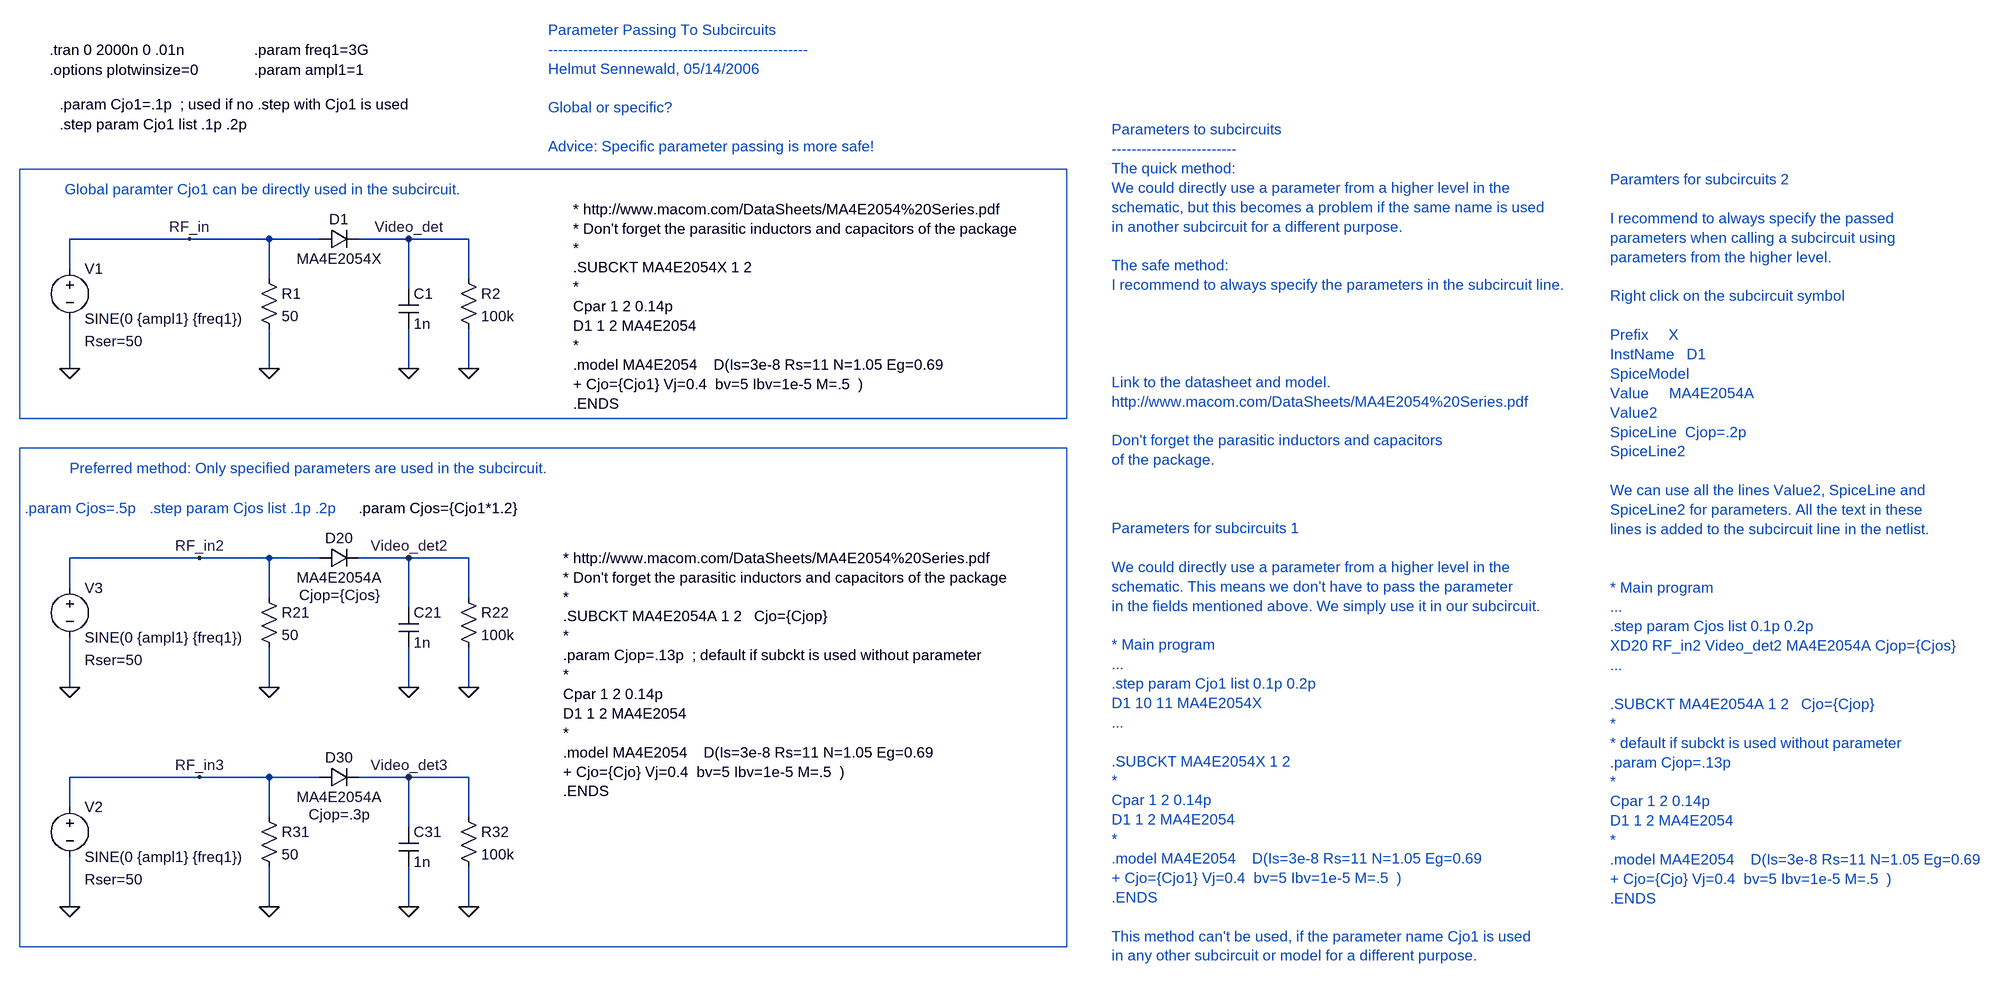
[diagram p0: schematic Param_to_sub_MA4E2054.asc]
Param_to_sub_MA4E2054.asc, the LTspice schematic file:
Version 4
SHEET 1 2796 1628
WIRE -496 48 -496 0
WIRE -496 208 -496 128
WIRE -496 560 -496 512
WIRE -496 720 -496 640
WIRE -496 912 -496 864
WIRE -496 1072 -496 992
WIRE -304 0 -496 0
WIRE -288 512 -496 512
WIRE -288 864 -496 864
WIRE -176 0 -304 0
WIRE -176 64 -176 0
WIRE -176 208 -176 144
WIRE -176 512 -288 512
WIRE -176 576 -176 512
WIRE -176 720 -176 656
WIRE -176 864 -288 864
WIRE -176 928 -176 864
WIRE -176 1072 -176 1008
WIRE -96 0 -176 0
WIRE -96 512 -176 512
WIRE -96 864 -176 864
WIRE 48 0 -32 0
WIRE 48 80 48 0
WIRE 48 208 48 144
WIRE 48 512 -32 512
WIRE 48 592 48 512
WIRE 48 720 48 656
WIRE 48 864 -32 864
WIRE 48 944 48 864
WIRE 48 1072 48 1008
WIRE 144 0 48 0
WIRE 144 64 144 0
WIRE 144 208 144 144
WIRE 144 512 48 512
WIRE 144 576 144 512
WIRE 144 720 144 656
WIRE 144 864 48 864
WIRE 144 928 144 864
WIRE 144 1072 144 1008
FLAG -496 208 0
FLAG -304 0 RF_in
FLAG -176 208 0
FLAG 48 208 0
FLAG 144 208 0
FLAG 48 0 Video_det
FLAG -176 1072 0
FLAG 48 1072 0
FLAG 144 1072 0
FLAG 48 864 Video_det3
FLAG -288 864 RF_in3
FLAG -176 720 0
FLAG 48 720 0
FLAG 144 720 0
FLAG 48 512 Video_det2
FLAG -496 1072 0
FLAG -496 720 0
FLAG -288 512 RF_in2
SYMBOL diode -96 16 R270
WINDOW 0 32 32 VTop 0
WINDOW 3 0 32 VBottom 0
SYMATTR InstName D1
SYMATTR Value MA4E2054X
SYMATTR Prefix X
SYMBOL res -192 48 R0
SYMATTR InstName R1
SYMATTR Value 50
SYMBOL voltage -496 32 R0
WINDOW 123 0 0 Left 0
WINDOW 39 24 132 Left 0
SYMATTR InstName V1
SYMATTR Value SINE(0 {ampl1} {freq1})
SYMATTR SpiceLine Rser=50
SYMBOL cap 32 80 R0
SYMATTR InstName C1
SYMATTR Value 1n
SYMBOL res 128 48 R0
SYMATTR InstName R2
SYMATTR Value 100k
SYMBOL diode -96 880 R270
WINDOW 0 32 32 VTop 0
WINDOW 3 0 32 VBottom 0
WINDOW 39 -28 32 VBottom 0
SYMATTR InstName D30
SYMATTR Value MA4E2054A
SYMATTR Prefix X
SYMATTR SpiceLine Cjop=.3p
SYMBOL res -192 912 R0
SYMATTR InstName R31
SYMATTR Value 50
SYMBOL cap 32 944 R0
SYMATTR InstName C31
SYMATTR Value 1n
SYMBOL res 128 912 R0
SYMATTR InstName R32
SYMATTR Value 100k
SYMBOL diode -96 528 R270
WINDOW 0 32 32 VTop 0
WINDOW 3 0 32 VBottom 0
WINDOW 39 -28 32 VBottom 0
SYMATTR InstName D20
SYMATTR Value MA4E2054A
SYMATTR Prefix X
SYMATTR SpiceLine Cjop={Cjos}
SYMBOL res -192 560 R0
SYMATTR InstName R21
SYMATTR Value 50
SYMBOL cap 32 592 R0
SYMATTR InstName C21
SYMATTR Value 1n
SYMBOL res 128 560 R0
SYMATTR InstName R22
SYMATTR Value 100k
SYMBOL voltage -496 896 R0
WINDOW 123 0 0 Left 0
WINDOW 39 24 132 Left 0
SYMATTR InstName V2
SYMATTR Value SINE(0 {ampl1} {freq1})
SYMATTR SpiceLine Rser=50
SYMBOL voltage -496 544 R0
WINDOW 123 0 0 Left 0
WINDOW 39 24 132 Left 0
SYMATTR InstName V3
SYMATTR Value SINE(0 {ampl1} {freq1})
SYMATTR SpiceLine Rser=50
TEXT 296 512 Left 0 !* http://www.macom.com/DataSheets/MA4E2054%20Series.pdf\n* Don't forget the parasitic inductors and capacitors of the package\n*\n.SUBCKT MA4E2054A 1 2   Cjo={Cjop}\n*\n.param Cjop=.13p  ; default if subckt is used without parameter\n*\nCpar 1 2 0.14p\nD1 1 2 MA4E2054\n*\n.model MA4E2054    D(Is=3e-8 Rs=11 N=1.05 Eg=0.69\n+ Cjo={Cjo} Vj=0.4  bv=5 Ibv=1e-5 M=.5  )\n.ENDS
TEXT -528 -304 Left 0 !.tran 0 2000n 0 .01n
TEXT -528 -272 Left 0 !.options plotwinsize=0
TEXT -512 -216 Left 0 !.param Cjo1=.1p  ; used if no .step with Cjo1 is used
TEXT -512 -184 Left 0 !.step param Cjo1 list .1p .2p
TEXT 312 -48 Left 0 !* http://www.macom.com/DataSheets/MA4E2054%20Series.pdf\n* Don't forget the parasitic inductors and capacitors of the package\n*\n.SUBCKT MA4E2054X 1 2 \n*\nCpar 1 2 0.14p\nD1 1 2 MA4E2054\n*\n.model MA4E2054    D(Is=3e-8 Rs=11 N=1.05 Eg=0.69\n+ Cjo={Cjo1} Vj=0.4  bv=5 Ibv=1e-5 M=.5  )\n.ENDS
TEXT -568 432 Left 0 ;.param Cjos=.5p
TEXT -32 432 Left 0 !.param Cjos={Cjo1*1.2}
TEXT -504 -80 Left 0 ;Global paramter Cjo1 can be directly used in the subcircuit.
TEXT -496 368 Left 0 ;Preferred method: Only specified parameters are used in the subcircuit.
TEXT -200 -304 Left 0 !.param freq1=3G
TEXT -200 -272 Left 0 !.param ampl1=1
TEXT 272 -336 Left 0 ;Parameter Passing To Subcircuits\n----------------------------------------------------\nHelmut Sennewald, 05/14/2006\n \nGlobal or specific?\n \nAdvice: Specific parameter passing is more safe!
TEXT 1176 464 Left 0 ;Parameters for subcircuits 1\n \nWe could directly use a parameter from a higher level in the\nschematic. This means we don't have to pass the parameter \nin the fields mentioned above. We simply use it in our subcircuit.\n \n* Main program\n...\n.step param Cjo1 list 0.1p 0.2p\nD1 10 11 MA4E2054X\n...\n \n.SUBCKT MA4E2054X 1 2 \n*\nCpar 1 2 0.14p\nD1 1 2 MA4E2054\n*\n.model MA4E2054    D(Is=3e-8 Rs=11 N=1.05 Eg=0.69\n+ Cjo={Cjo1} Vj=0.4  bv=5 Ibv=1e-5 M=.5  )\n.ENDS\n \nThis method can't be used, if the parameter name Cjo1 is used \nin any other subcircuit or model for a different purpose.
TEXT 1976 -96 Left 0 ;Paramters for subcircuits 2\n \nI recommend to always specify the passed \nparameters when calling a subcircuit using \nparameters from the higher level.\n \nRight click on the subcircuit symbol \n \nPrefix     X\nInstName   D1\nSpiceModel\nValue     MA4E2054A\nValue2\nSpiceLine  Cjop=.2p   \nSpiceLine2\n \nWe can use all the lines Value2, SpiceLine and \nSpiceLine2 for parameters. All the text in these \nlines is added to the subcircuit line in the netlist.\n \n \n* Main program\n...\n.step param Cjos list 0.1p 0.2p\nXD20 RF_in2 Video_det2 MA4E2054A Cjop={Cjos}\n...\n \n.SUBCKT MA4E2054A 1 2   Cjo={Cjop}\n*\n* default if subckt is used without parameter\n.param Cjop=.13p  \n*\nCpar 1 2 0.14p\nD1 1 2 MA4E2054\n*\n.model MA4E2054    D(Is=3e-8 Rs=11 N=1.05 Eg=0.69\n+ Cjo={Cjo} Vj=0.4  bv=5 Ibv=1e-5 M=.5  )\n.ENDS
TEXT 1176 -176 Left 0 ;Parameters to subcircuits\n------------------------- \nThe quick method:\nWe could directly use a parameter from a higher level in the\nschematic, but this becomes a problem if the same name is used\nin another subcircuit for a different purpose. \n \nThe safe method:\nI recommend to always specify the parameters in the subcircuit line.\n \n \n \n \nLink to the datasheet and model.\nhttp://www.macom.com/DataSheets/MA4E2054%20Series.pdf\n \nDon't forget the parasitic inductors and capacitors \nof the package.
TEXT -368 432 Left 0 ;.step param Cjos list .1p .2p
RECTANGLE Normal 1104 288 -576 -112
RECTANGLE Normal 1104 1136 -576 336

The netlist it stands for:
* Param_to_sub_MA4E2054.asc
XD1 RF_in Video_det MA4E2054X  ; pins + -
R1 RF_in 0 50
V1 RF_in 0 SINE(0 {ampl1} {freq1}) Rser=50
C1 Video_det 0 1n
R2 Video_det 0 100k
XD30 RF_in3 Video_det3 MA4E2054A Cjop=.3p  ; pins + -
R31 RF_in3 0 50
C31 Video_det3 0 1n
R32 Video_det3 0 100k
XD20 RF_in2 Video_det2 MA4E2054A Cjop={Cjos}  ; pins + -
R21 RF_in2 0 50
C21 Video_det2 0 1n
R22 Video_det2 0 100k
V2 RF_in3 0 SINE(0 {ampl1} {freq1}) Rser=50
V3 RF_in2 0 SINE(0 {ampl1} {freq1}) Rser=50
* http://www.macom.com/DataSheets/MA4E2054%20Series.pdf
* Don't forget the parasitic inductors and capacitors of the package
*
.SUBCKT MA4E2054A 1 2   Cjo={Cjop}
*
.param Cjop=.13p  ; default if subckt is used without parameter
*
Cpar 1 2 0.14p
D1 1 2 MA4E2054
*
.model MA4E2054    D(Is=3e-8 Rs=11 N=1.05 Eg=0.69
+ Cjo={Cjo} Vj=0.4  bv=5 Ibv=1e-5 M=.5  )
.ENDS
.tran 0 2000n 0 .01n
.options plotwinsize=0
.param Cjo1=.1p  ; used if no .step with Cjo1 is used
.step param Cjo1 list .1p .2p
* http://www.macom.com/DataSheets/MA4E2054%20Series.pdf
* Don't forget the parasitic inductors and capacitors of the package
*
.SUBCKT MA4E2054X 1 2
*
Cpar 1 2 0.14p
D1 1 2 MA4E2054
*
.model MA4E2054    D(Is=3e-8 Rs=11 N=1.05 Eg=0.69
+ Cjo={Cjo1} Vj=0.4  bv=5 Ibv=1e-5 M=.5  )
.ENDS
* .param Cjos=.5p
.param Cjos={Cjo1*1.2}
* Global paramter Cjo1 can be directly used in the subcircuit.
* Preferred method: Only specified parameters are used in the subcircuit.
.param freq1=3G
.param ampl1=1
* Parameter Passing To Subcircuits
* ----------------------------------------------------
* Helmut Sennewald, 05/14/2006
* Global or specific?
* Advice: Specific parameter passing is more safe!
* Parameters for subcircuits 1
* We could directly use a parameter from a higher level in the
* schematic. This means we don't have to pass the parameter
* in the fields mentioned above. We simply use it in our subcircuit.
* * Main program
* ...
* .step param Cjo1 list 0.1p 0.2p
* D1 10 11 MA4E2054X
* ...
* .SUBCKT MA4E2054X 1 2
* *
* Cpar 1 2 0.14p
* D1 1 2 MA4E2054
* *
* .model MA4E2054    D(Is=3e-8 Rs=11 N=1.05 Eg=0.69
* + Cjo={Cjo1} Vj=0.4  bv=5 Ibv=1e-5 M=.5  )
* .ENDS
* This method can't be used, if the parameter name Cjo1 is used
* in any other subcircuit or model for a different purpose.
* Paramters for subcircuits 2
* I recommend to always specify the passed
* parameters when calling a subcircuit using
* parameters from the higher level.
* Right click on the subcircuit symbol
* Prefix     X
* InstName   D1
* SpiceModel
* Value     MA4E2054A
* Value2
* SpiceLine  Cjop=.2p
* SpiceLine2
* We can use all the lines Value2, SpiceLine and
* SpiceLine2 for parameters. All the text in these
* lines is added to the subcircuit line in the netlist.
* * Main program
* ...
* .step param Cjos list 0.1p 0.2p
* XD20 RF_in2 Video_det2 MA4E2054A Cjop={Cjos}
* ...
* .SUBCKT MA4E2054A 1 2   Cjo={Cjop}
* *
* * default if subckt is used without parameter
* .param Cjop=.13p
* *
* Cpar 1 2 0.14p
* D1 1 2 MA4E2054
* *
* .model MA4E2054    D(Is=3e-8 Rs=11 N=1.05 Eg=0.69
* + Cjo={Cjo} Vj=0.4  bv=5 Ibv=1e-5 M=.5  )
* .ENDS
* Parameters to subcircuits
* -------------------------
* The quick method:
* We could directly use a parameter from a higher level in the
* schematic, but this becomes a problem if the same name is used
* in another subcircuit for a different purpose.
* The safe method:
* I recommend to always specify the parameters in the subcircuit line.
* Link to the datasheet and model.
* http://www.macom.com/DataSheets/MA4E2054%20Series.pdf
* Don't forget the parasitic inductors and capacitors
* of the package.
* .step param Cjos list .1p .2p
.backanno
.end